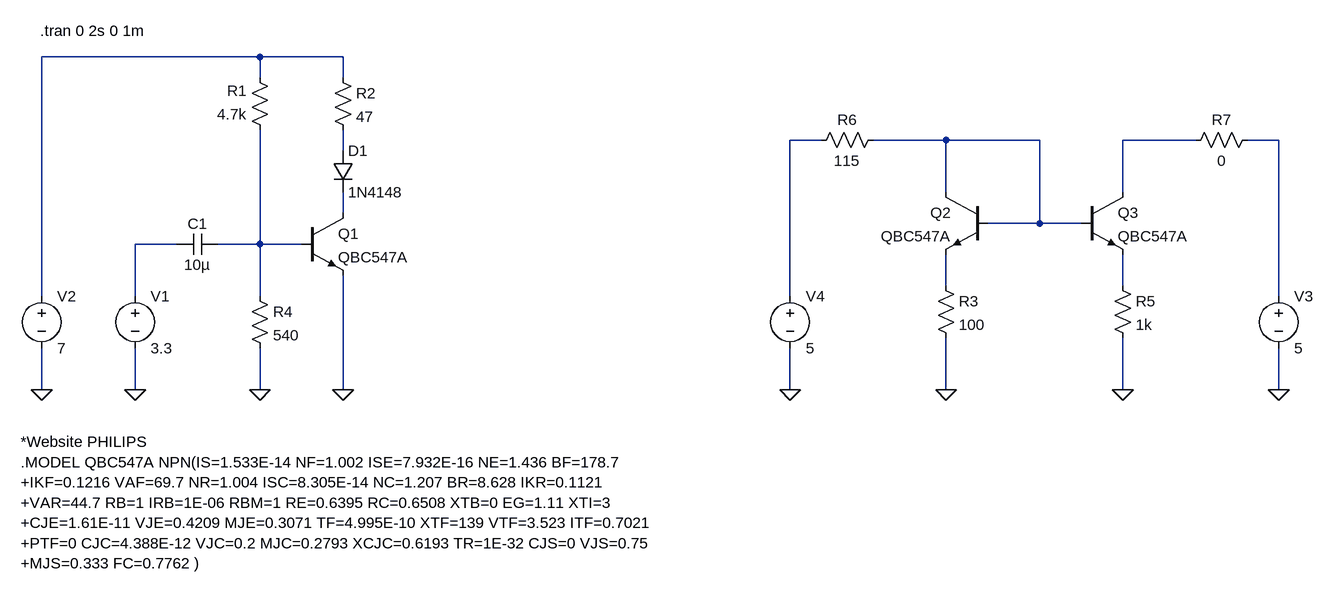
[diagram p0: schematic bipolar_amplifier.asc]
bipolar_amplifier.asc, the LTspice schematic file:
Version 4
SHEET 1 2420 680
WIRE -240 -240 -576 -240
WIRE -112 -240 -240 -240
WIRE -240 -208 -240 -240
WIRE -112 -208 -112 -240
WIRE 624 -112 576 -112
WIRE 816 -112 704 -112
WIRE 960 -112 816 -112
WIRE 1200 -112 1088 -112
WIRE 1328 -112 1280 -112
WIRE -112 -96 -112 -128
WIRE 816 -32 816 -112
WIRE 1088 -32 1088 -112
WIRE -112 0 -112 -32
WIRE 960 16 960 -112
WIRE 960 16 880 16
WIRE 1024 16 960 16
WIRE -368 48 -432 48
WIRE -240 48 -240 -128
WIRE -240 48 -304 48
WIRE -176 48 -240 48
WIRE 816 112 816 64
WIRE 1088 112 1088 64
WIRE -576 128 -576 -240
WIRE -432 128 -432 48
WIRE -240 128 -240 48
WIRE 576 128 576 -112
WIRE 1328 128 1328 -112
WIRE -576 272 -576 208
WIRE -432 272 -432 208
WIRE -240 272 -240 208
WIRE -112 272 -112 96
WIRE 576 272 576 208
WIRE 816 272 816 192
WIRE 1088 272 1088 192
WIRE 1328 272 1328 208
FLAG -432 272 0
FLAG -112 272 0
FLAG -576 272 0
FLAG 816 272 0
FLAG 576 272 0
FLAG -240 272 0
FLAG 1088 272 0
FLAG 1328 272 0
SYMBOL npn -176 0 R0
SYMATTR InstName Q1
SYMATTR Value QBC547A
SYMBOL voltage -432 112 R0
WINDOW 123 0 0 Left 2
WINDOW 39 0 0 Left 2
SYMATTR InstName V1
SYMATTR Value 3.3
SYMBOL res -224 -112 R180
WINDOW 0 36 76 Left 2
WINDOW 3 36 40 Left 2
SYMATTR InstName R1
SYMATTR Value 4.7k
SYMBOL voltage -576 112 R0
SYMATTR InstName V2
SYMATTR Value 7
SYMBOL res -128 -224 R0
SYMATTR InstName R2
SYMATTR Value 47
SYMBOL diode -128 -96 R0
SYMATTR InstName D1
SYMATTR Value 1N4148
SYMATTR Description Light Emitting Diode
SYMATTR Type led
SYMBOL npn 880 -32 M0
SYMATTR InstName Q2
SYMATTR Value QBC547A
SYMBOL res 800 96 R0
SYMATTR InstName R3
SYMATTR Value 100
SYMBOL voltage 576 112 R0
SYMATTR InstName V4
SYMATTR Value 5
SYMBOL res -256 112 R0
SYMATTR InstName R4
SYMATTR Value 540
SYMBOL cap -304 32 R90
WINDOW 0 0 32 VBottom 2
WINDOW 3 32 32 VTop 2
SYMATTR InstName C1
SYMATTR Value 10µ
SYMBOL npn 1024 -32 R0
SYMATTR InstName Q3
SYMATTR Value QBC547A
SYMBOL res 1072 96 R0
SYMATTR InstName R5
SYMATTR Value 1k
SYMBOL res 720 -128 R90
WINDOW 0 0 56 VBottom 2
WINDOW 3 32 56 VTop 2
SYMATTR InstName R6
SYMATTR Value 115
SYMBOL voltage 1328 112 R0
SYMATTR InstName V3
SYMATTR Value 5
SYMBOL res 1296 -128 R90
WINDOW 0 0 56 VBottom 2
WINDOW 3 32 56 VTop 2
SYMATTR InstName R7
SYMATTR Value 0
TEXT -578 -280 Left 2 !.tran 0 2s 0 1m
TEXT -608 352 Left 2 !*Website PHILIPS\n.MODEL QBC547A NPN(IS=1.533E-14 NF=1.002 ISE=7.932E-16 NE=1.436 BF=178.7\n+IKF=0.1216 VAF=69.7 NR=1.004 ISC=8.305E-14 NC=1.207 BR=8.628 IKR=0.1121\n+VAR=44.7 RB=1 IRB=1E-06 RBM=1 RE=0.6395 RC=0.6508 XTB=0 EG=1.11 XTI=3\n+CJE=1.61E-11 VJE=0.4209 MJE=0.3071 TF=4.995E-10 XTF=139 VTF=3.523 ITF=0.7021\n+PTF=0 CJC=4.388E-12 VJC=0.2 MJC=0.2793 XCJC=0.6193 TR=1E-32 CJS=0 VJS=0.75\n+MJS=0.333 FC=0.7762 )

The netlist it stands for:
* bipolar_amplifier.asc
Q1 N007 N009 0 0 QBC547A
V1 N008 0 3.3
R1 N009 N001 4.7k
V2 N001 0 7
R2 N001 N006 47
D1 N006 N007 1N4148
Q2 N003 N003 N010 0 QBC547A
R3 N010 0 100
V4 N002 0 5
R4 N009 0 540
C1 N009 N008 10µ
Q3 N004 N003 N011 0 QBC547A
R5 N011 0 1k
R6 N003 N002 115
V3 N005 0 5
R7 N005 N004 0
.model D D
.lib standard.dio
.model NPN NPN
.model PNP PNP
.lib standard.bjt
.tran 0 2s 0 1m
*Website PHILIPS
.MODEL QBC547A NPN(IS=1.533E-14 NF=1.002 ISE=7.932E-16 NE=1.436 BF=178.7
+IKF=0.1216 VAF=69.7 NR=1.004 ISC=8.305E-14 NC=1.207 BR=8.628 IKR=0.1121
+VAR=44.7 RB=1 IRB=1E-06 RBM=1 RE=0.6395 RC=0.6508 XTB=0 EG=1.11 XTI=3
+CJE=1.61E-11 VJE=0.4209 MJE=0.3071 TF=4.995E-10 XTF=139 VTF=3.523 ITF=0.7021
+PTF=0 CJC=4.388E-12 VJC=0.2 MJC=0.2793 XCJC=0.6193 TR=1E-32 CJS=0 VJS=0.75
+MJS=0.333 FC=0.7762 )
.backanno
.end